# EAGLE design main (EAGLE 9.1.1)
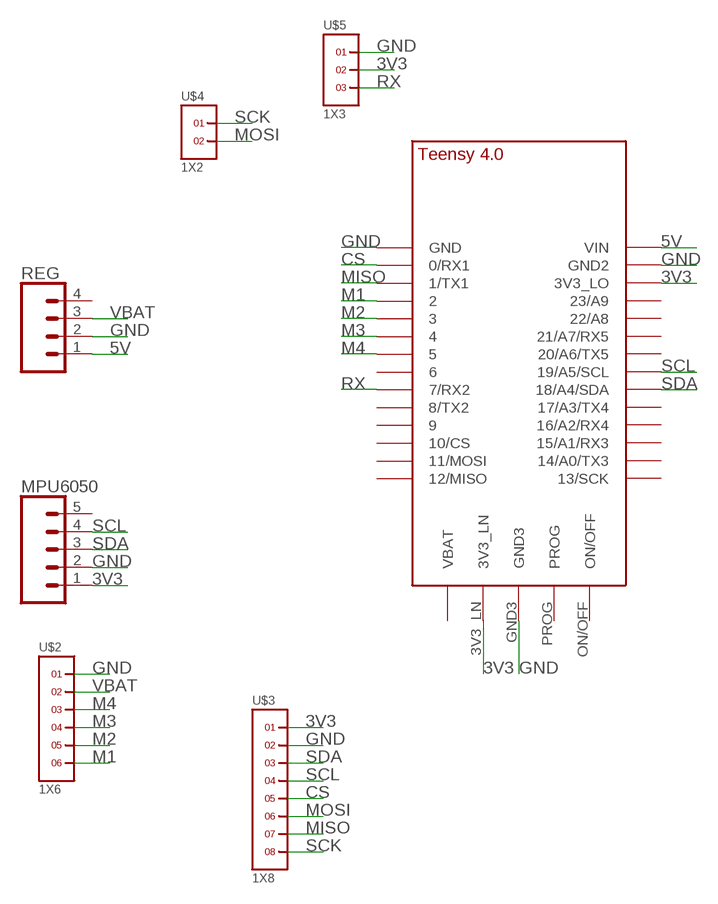
[diagram p0: schematic, sheet 1]

## Parts
MPU6050  CONN_05NO_SILK  [1X05_NO_SILK]
REG  CONN_041X04_NO_SILK  [1X04_NO_SILK]
U$1  TEENSY_4.0  [TEENSY_4.0]
U$2  1X6  [1X6]
U$3  1X8  [1X8]
U$4  1X2  [1X2]
U$5  1X3  [1X3]

## Nets
3V3: MPU6050.1 U$1.3V3_LN U$1.3V3_LO U$3.1 U$5.2
5V: REG.1 U$1.VIN
CS: U$1.0/RX(0/RX1) U$3.5
GND: MPU6050.2 REG.2 U$1.GND U$1.GND2 U$1.GND3 U$2.1 U$3.2 U$5.1
M1: U$1.2 U$2.6
M2: U$1.3/CANTX U$2.5
M3: U$1.4/CANRX U$2.4
M4: U$1.5 U$2.3
MISO: U$1.1/TX(1/TX1) U$3.7
MOSI: U$3.6 U$4.2
RX: U$1.7(7/RX2) U$5.3
SCK: U$3.8 U$4.1
SCL: MPU6050.4 U$1.19/A5/SCL U$3.4
SDA: MPU6050.3 U$1.18/A4/SDA U$3.3
VBAT: REG.3 U$2.2
Unconnected: MPU6050.5 REG.4 U$1.6 U$1.8(8/TX2) U$1.9/CS U$1.10/CS U$1.11/MOSI U$1.12/MISO U$1.13/SCK U$1.14/A0(14/A0/TX3) U$1.15/A1(15/A1/RX3) U$1.16/A2(16/A2/RX4) U$1.17/A3(17/A3/TX4) U$1.20/A6(20/A6/TX5) U$1.21/A7(21/A7/RX5) U$1.22/A8 U$1.23/A9 U$1.ON/OFF U$1.PROG U$1.VBAT\(VBAT)

## Library data of the parts
MPU6050 = SparkFun-Connectors:CONN_05: Multi connection point. Often used as Generic Header-pin footprint for 0.1 inch spaced/style header connections On any of the 0.1 inch spaced packages, you can populate with these: Break Away Headers - Straight <https://www.sparkfun.com/products/116> (PRT-00116) Break Away Male Headers - Right Angle <https://www.sparkfun.com/products/553> (PRT-00553) Female Headers <https://www.sparkfun.com/products/115> (PRT-00115) Break Away Headers - Machine Pin <https://www.sparkfun.com/products/117> (PRT-00117) Break Away Female Headers - Swiss Machine Pin <https://www.sparkfun.com/products/743> (PRT-00743) For SCREWTERMINALS and SPRING TERMINALS visit here: Screw Terimnals on SparkFun.com <https://www.sparkfun.com/search/results?term=Screw+Terminals> (5mm/3.5mm/2.54mm spacing) This device is also useful as a general connection point to wire up your design to another part of your project. Our various solder wires solder well into these plated through hole pads. Hook-Up Wire - Assortment (Stranded, 22 AWG) <https://www.sparkfun.com/products/11375> (PRT-11375) Hook-Up Wire - Assortment (Solid Core, 22 AWG) <https://www.sparkfun.com/products/11367> (PRT-11367) View the entire wire category on our website here <https://www.sparkfun.com/categories/141> Special notes: Molex polarized connector foot print use with SKU : PRT-08231 with associated crimp pins and housings. 1MM SMD Version SKU: PRT-10208
REG = SparkFun-Connectors:CONN_04: Multi connection point. Often used as Generic Header-pin footprint for 0.1 inch spaced/style header connections On any of the 0.1 inch spaced packages, you can populate with these: Break Away Headers - Straight <https://www.sparkfun.com/products/116> (PRT-00116) Break Away Male Headers - Right Angle <https://www.sparkfun.com/products/553> (PRT-00553) Female Headers <https://www.sparkfun.com/products/115> (PRT-00115) Break Away Headers - Machine Pin <https://www.sparkfun.com/products/117> (PRT-00117) Break Away Female Headers - Swiss Machine Pin <https://www.sparkfun.com/products/743> (PRT-00743) For SCREWTERMINALS and SPRING TERMINALS visit here: Screw Terimnals on SparkFun.com <https://www.sparkfun.com/search/results?term=Screw+Terminals> (5mm/3.5mm/2.54mm spacing) This device is also useful as a general connection point to wire up your design to another part of your project. Our various solder wires solder well into these plated through hole pads. Hook-Up Wire - Assortment (Stranded, 22 AWG) <https://www.sparkfun.com/products/11375> (PRT-11375) Hook-Up Wire - Assortment (Solid Core, 22 AWG) <https://www.sparkfun.com/products/11367> (PRT-11367) View the entire wire category on our website here <https://www.sparkfun.com/categories/141> Special notes: Molex polarized connector foot print use with SKU : PRT-08231 with associated crimp pins and housings. 1MM SMD Version SKU: PRT-10208; PROD_ID: CONN-09696
U$1 = TEENSY 4.0:TEENSY_4.0
U$2 = headers(2mm):1X6
U$3 = headers(2mm):1X8
U$4 = headers(2mm):1X2
U$5 = headers(2mm):1X3

## Board
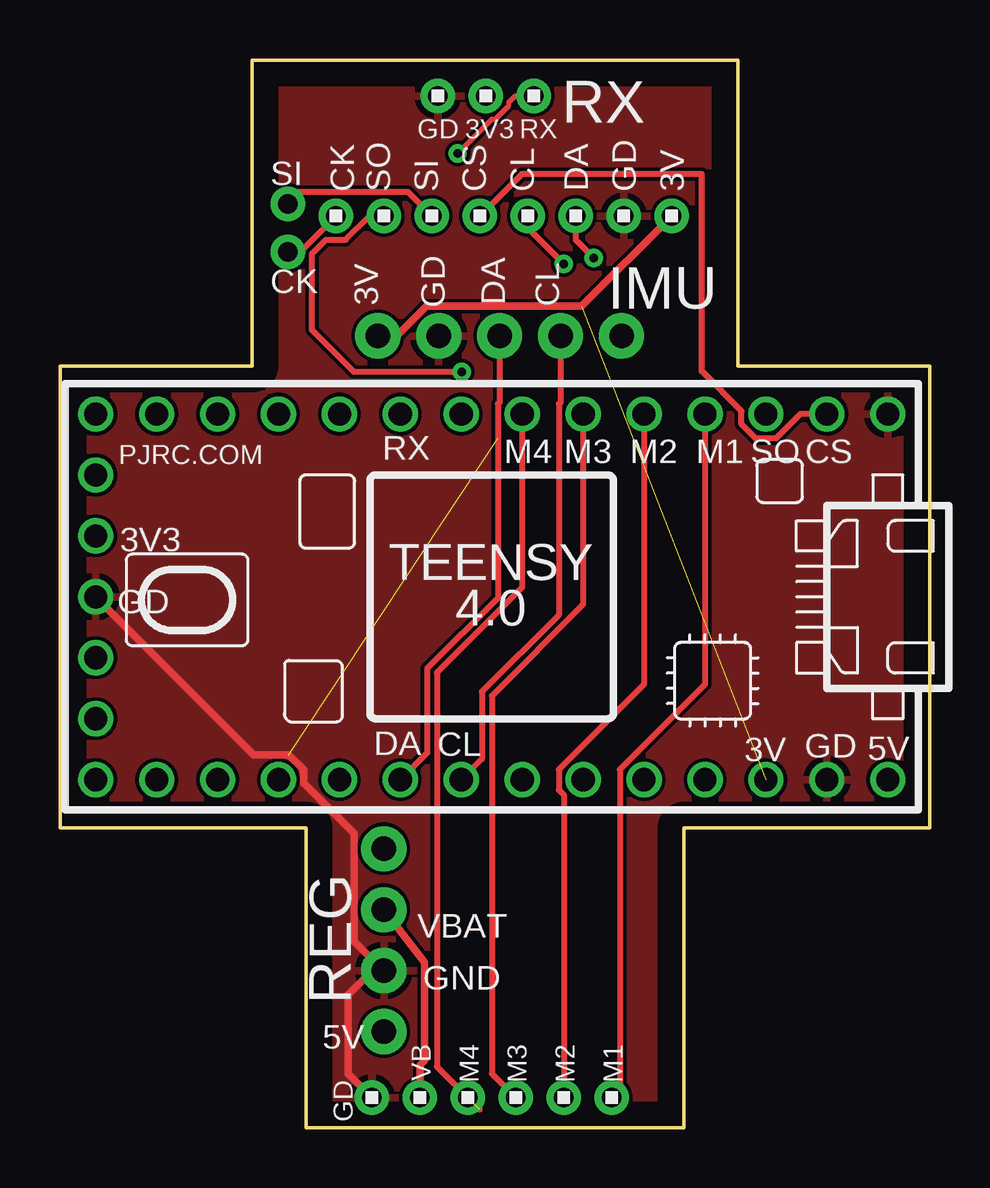
[diagram p1: board, top side]
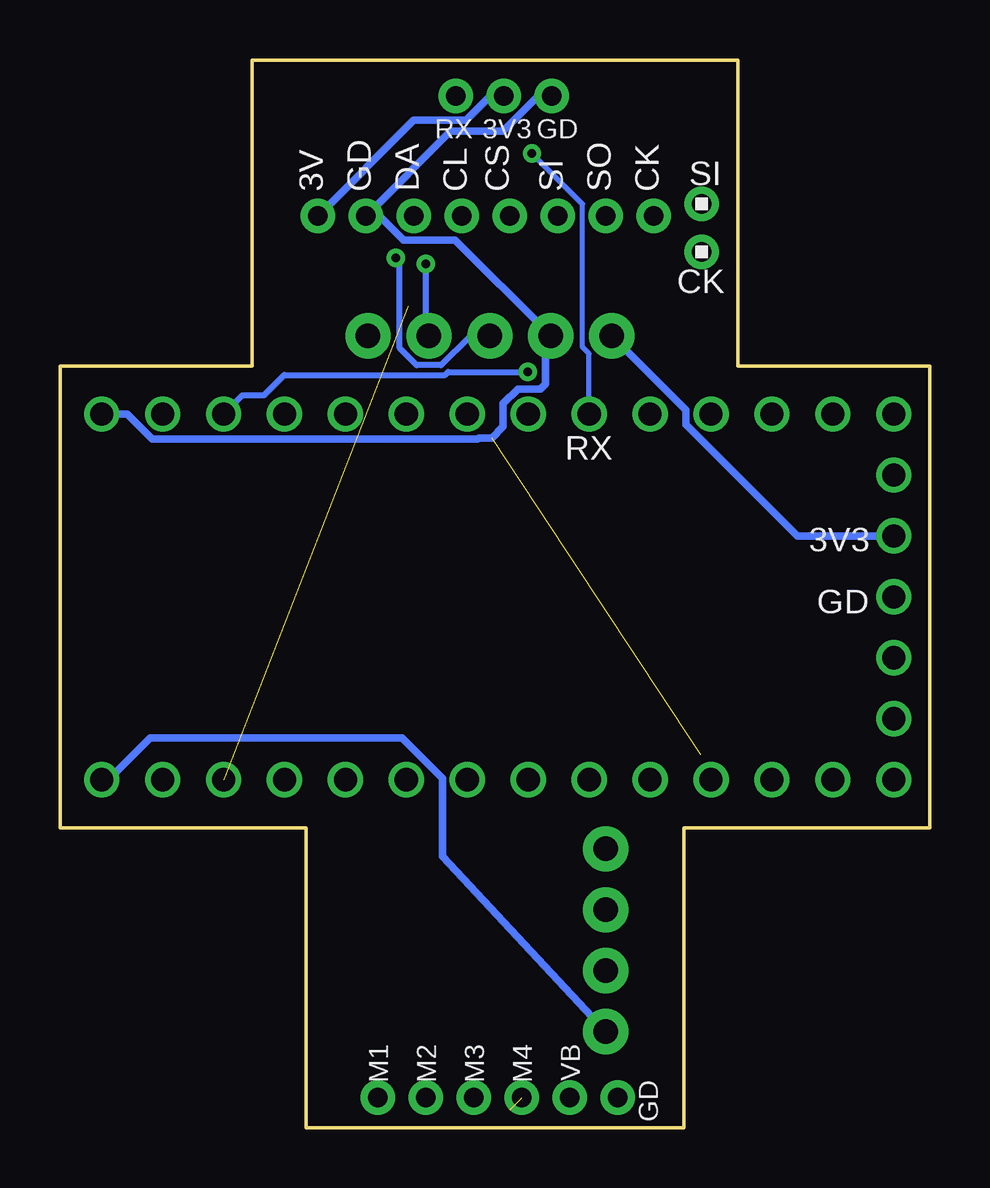
[diagram p2: board, bottom side, seen from below]

Size 36.25 x 44.5 mm. Coordinates in mm from the lower left corner, seen from the top.
Outline: 8,44.5 28.25,44.5 28.25,31.75 36.25,31.75 36.25,12.5 26,12.5 26,0 10.25,0 10.25,12.5 0,12.5 0,31.75 8,31.75 8,44.5
Copper layers (1*16): Top 0.035mm / dielectric 1.5mm / Bottom 0.035mm
Design rules "default": minimum track width 6mil, minimum drill 0.35mm, track to track 6mil, track to pad 6mil, pad to pad 6mil, via to via 6mil, smd to smd 6mil, copper to edge 40mil, drill to drill 6mil, minimum pad ring 10mil, minimum via ring 8mil, stop-mask expansion 4mil, vias tented up to drill 0mil, thermal gap 10mil

### Footprints (pad centres in the part's own frame; a part is rotated, then mirrored left to right if it is on the bottom)
1X05_NO_SILK = drill 1.016 pad 1.88: 1 0,0; 2 2.54,0; 3 5.08,0; 4 7.62,0; 5 10.16,0
1X04_NO_SILK = drill 1.016 pad 1.88: 1 0,0; 2 2.54,0; 3 5.08,0; 4 7.62,0
TEENSY_4.0 = drill 0.965: 0/RX -13.97,-7.62; 1/TX -11.43,-7.62; 2 -8.89,-7.62; 3/CANTX -6.35,-7.62; 3V3_LN 16.51,-2.54; 3V3_LO -11.43,7.62; 4/CANRX -3.81,-7.62; 5 -1.27,-7.62; 6 1.27,-7.62; 7 3.81,-7.62; 8 6.35,-7.62; 9/CS 8.89,-7.62; 10/CS 11.43,-7.62; 11/MOSI 13.97,-7.62; 12/MISO 16.51,-7.62; 13/SCK 16.51,7.62; 14/A0 13.97,7.62; 15/A1 11.43,7.62; 16/A2 8.89,7.62; 17/A3 6.35,7.62; 18/A4/SDA 3.81,7.62; 19/A5/SCL 1.27,7.62; 20/A6 -1.27,7.62; 21/A7 -3.81,7.62; 22/A8 -6.35,7.62; 23/A9 -8.89,7.62; GND -16.51,-7.62; GND2 -13.97,7.62; GND3 16.51,0; ON/OFF 16.51,5.08; PROG 16.51,2.54; VBAT\ 16.51,-5.08; VIN -16.51,7.62
1X6 = drill 0.8 pad 1.422: 1 -5,0; 2 -3,0; 3 -1,0; 4 1,0; 5 3,0; 6 5,0
1X8 = drill 0.8 pad 1.422: 1 -7,0; 2 -5,0; 3 -3,0; 4 -1,0; 5 1,0; 6 3,0; 7 5,0; 8 7,0
1X2 = drill 0.8 pad 1.422: 1 -1,0; 2 1,0
1X3 = drill 0.8 pad 1.422: 1 -2,0; 2 0,0; 3 2,0

### Placement (x,y rotation side)
MPU6050  13.25,33 0 top
REG  13.5,4 90 top
U$1  18,22.12 180 top
U$2  18,1.25 0 top
U$3  18.5,38 180 top
U$4  9.5,37.5 90 bottom
U$5  17.75,43 0 top

### Tracks (layer width: path | path; a pad name or v marks a point on that pad's centre or on a via)
3V3  (1 unrouted)
  Top 0.305: MPU6050.1 14.03,33 15.27,34.24 21.74,34.24 U$3.1
  Bottom 0.305: MPU6050.1 10.15,29.9 10.15,29.31 5.5,24.66 U$1.3V3_LN | U$5.2 18.31,43 19.33,41.98 21.52,41.98 U$3.1
5V
  Bottom 0.305: U$1.VIN 34.25,14.5 32.5,16.25 22,16.25 20.31,14.56 20.31,11.31 REG.1
CS
  Top 0.254: U$1.0/RX 30.87,29.74 29.85,28.72 29.01,28.72 28.41,29.32 28.41,29.86 26.75,31.53 26.75,39.75 19.25,39.75 U$3.5
GND  (1 unrouted)
  Top 0.305: MPU6050.2 16.57,33 | U$2.1 12,2.25 12,5.54 13.23,6.77 13.4,6.63 | 13.4,6.63 REG.2 | U$1.GND3 8.07,15.54 9.54,15.54 10.15,14.93 10.15,14.36 12.26,12.25 12.26,7.77 13.4,6.63
  Bottom 0.305: 16.02,33.23 19.77,36.98 21.92,36.98 22.94,38 U$3.2 19.97,41.53 17.79,41.53 16.31,43 U$5.1 | 16.02,33.23 MPU6050.2 | U$1.GND 33.44,29.74 32.4,28.7 18.84,28.7 18.79,28.75 18.25,28.75 17.77,29.23 17.77,30.17 17.16,30.78 16.22,30.78 16.02,30.98 16.02,33.23
  pour Top: 37.25,49 37.25,-1.92 -3,-1.92 -3,49
M1
  Top 0.254: U$2.6 23.33,1.58 23.33,14.92 26.89,18.48 U$1.2
M2
  Top 0.254: U$2.5 21,13.87 20.79,14.08 20.79,14.92 24.35,18.48 U$1.3/CANTX
M3
  Top 0.254: U$1.4/CANRX 21.81,21.81 18,18 18,2.25 U$2.4
M4  (1 unrouted)
  Top 0.254: U$1.5 19.27,22.52 15.71,18.96 15.71,2.54 17.5,0.75
MISO  (via drill 0.35)
  Top 0.254: v16.75,31.5 12.25,31.5 10.5,33.25 10.5,36.42 11.08,37.01 11.91,37.01 12.9,38 U$3.7
  Bottom 0.254: U$1.1/TX 28.64,30.53 27.74,30.53 26.9,31.37 20.2,31.37 20.07,31.5 v16.75,31.5
MOSI
  Top 0.254: U$3.6 14.5,39 9.75,39 9.75,38.75 U$4.2
RX  (via drill 0.35)
  Top 0.203: U$5.3 18.97,43 18.72,42.74 18.72,42.6 18.15,42.03 18.01,42.03 v16.58,40.6
  Bottom 0.203: U$1.7 14.19,32.25 14.47,32.53 14.47,38.49 v16.58,40.6
SCK
  Top 0.254: U$4.1 10,36.5 U$3.8
SCL  (via drill 0.35)
  Top 0.254: v21,36 19.5,37.5 U$3.4 | MPU6050.4 20.87,30.24 20.79,30.16 20.79,21.37 17.59,18.17 17.59,15.36 U$1.19/A5/SCL
  Bottom 0.254: MPU6050.4 21,33.13 v21,36
SDA  (via drill 0.35)
  Top 0.254: v22.25,36.25 21.5,37 U$3.3 | MPU6050.3 18.33,30.24 18.25,30.16 18.25,22.08 15.31,19.13 15.31,15.62 U$1.18/A4/SDA
  Bottom 0.254: v22.25,36.25 22.09,36.09 22.09,32.49 21.38,31.78 20.37,31.78 19.15,33 MPU6050.3
VBAT
  Top 0.305: U$2.2 15,2.59 15.2,2.8 15.2,6.88 REG.3

### Text on the board
tNames: RX | GD | 3V3 | RX | SI | CK | SO | SI | CS | CL | DA | GD | 3V | IMU | CK | 3V | GD | DA | CL | RX | M4 | M3 | M2 | M1 | SO | CS | 3V3 | GD | DA | CL | 3V | 5V | GD | VBAT | REG | GND | 5V | VB | M4 | M3 | M2 | M1 | GD
bNames: GD | 3V3 | RX | SI | CK | SO | SI | CS | CL | DA | GD | 3V | CK | RX | 3V3 | GD | VB | M4 | M3 | M2 | M1 | GD